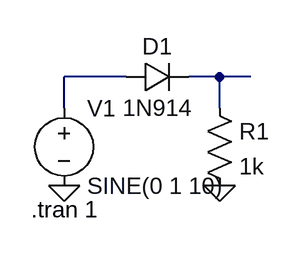
[diagram p0: schematic NonInvertingRectifier.asc]
NonInvertingRectifier.asc, the LTspice schematic file:
Version 4
SHEET 1 880 680
WIRE 160 176 96 176
WIRE 256 176 224 176
WIRE 288 176 256 176
WIRE 96 208 96 176
WIRE 256 208 256 176
FLAG 256 288 0
FLAG 96 288 0
SYMBOL diode 160 192 R270
WINDOW 0 32 32 VTop 2
WINDOW 3 0 32 VBottom 2
SYMATTR InstName D1
SYMATTR Value 1N914
SYMBOL res 240 192 R0
SYMATTR InstName R1
SYMATTR Value 1k
SYMBOL voltage 96 192 R0
WINDOW 123 0 0 Left 0
WINDOW 39 0 0 Left 0
SYMATTR InstName V1
SYMATTR Value SINE(0 1 10)
TEXT 62 312 Left 2 !.tran 1

The netlist it stands for:
* NonInvertingRectifier.asc
D1 N001 N002 1N914
R1 N002 0 1k
V1 N001 0 SINE(0 1 10)
.model D D
.lib standard.dio
.tran 1
.backanno
.end